# Altium schematic sheet FlowDiagramRev2.SchDoc
size A; SheetNumber: 9; SheetTotal: 14
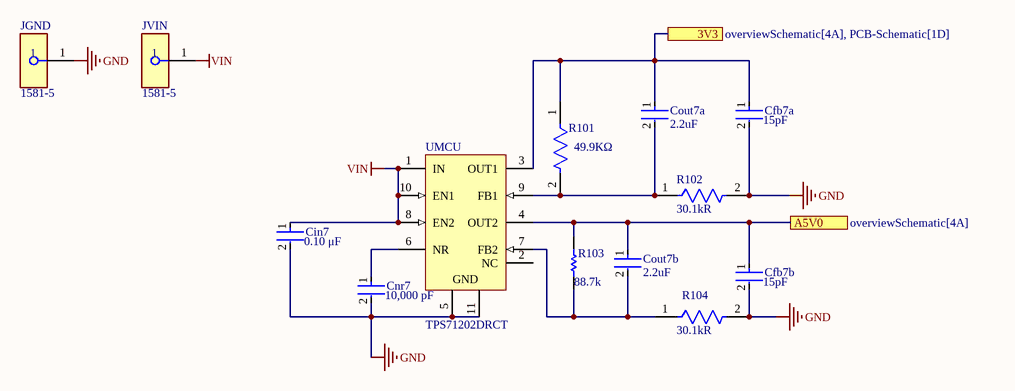
[diagram p0: FlowDiagramRev2.SchDoc]

## Parts
Cfb7a  Capacitance: 15pF  [FP-CC0402-0_55-IPC_B]  (hidden comment: CC0402JRNPO9BN150)
Cfb7b  Capacitance: 15pF  [FP-CC0402-0_55-IPC_B]  (hidden comment: CC0402JRNPO9BN150)
Cin7  Capacitance: 0.10 μF  [FP-C0603C-CF-MFG]  (hidden comment: C0603C104M4RACTU)
Cnr7  value 10,000 pF  [FP-C0603C-CF-MFG]  (hidden comment: C0603C103M5RACTU)
Cout7a  Capacitance: 2.2uF  [FP-GRM188-0_1-e0_2_0_5-MFG]  (hidden comment: GRM188R71A225KE15D)
Cout7b  Capacitance: 2.2uF  [FP-GRM188-0_1-e0_2_0_5-MFG]  (hidden comment: GRM188R71A225KE15D)
JGND  1581-5  [FP-1581-5-MFG]
JVIN  1581-5  [FP-1581-5-MFG]
R101  Resistance: 49.9KΩ  [FP-RT1206-MFG]  (hidden comment: RT1206FRE0749K9L)
R102  Resistance: 30.1kR  [FP-CRCW0603-HPe3-IPC_B]  (hidden comment: CRCW060330K1FKEAHP)
R103  RC0603FR-0788K7L  [RESC1608X55X25ML10T15]  (value not drawn)
R104  Resistance: 30.1kR  [FP-CRCW0603-HPe3-IPC_B]  (hidden comment: CRCW060330K1FKEAHP)
UMCU  TPS71202DRCT  [DRC0010L_V]

## Ports
3V3 (see overviewSchematic[4A], PCB-Schematic[1D]), A5V0 (see overviewSchematic[4A])

## Nets
GND: Cfb7a.2 Cfb7b.2 Cin7.2 Cnr7.2 JGND.1 R102.2 R104.2 UMCU.5(GND) UMCU.11(GND)
VIN: Cin7.1 JVIN.1 UMCU.1(IN) UMCU.8(EN2) UMCU.10(EN1)
3V3: Cfb7a.1 Cout7a.1 R101.1 UMCU.3(OUT1) ; port 3V3
A5V0: Cfb7b.1 Cout7b.1 R103.2 UMCU.4(OUT2) ; port A5V0
NetCnr7_1: Cnr7.1 UMCU.6(NR)
NetCout7a_2: Cout7a.2 R101.2 R102.1 UMCU.9(FB1)
NetCout7b_2: Cout7b.2 R103.1 R104.1 UMCU.7(FB2)

Not connected (* = marked no-connect by the designer): UMCU 2(NC)

## Notes on the sheet
- (near R103) 88.7k

## Library data of the parts
Cfb7a Cfb7b = CMP-03422-001519-1: CAP CER 15PF 50V C0G/NPO 0402; Insulation Resistance: 100GR; Dielectric Material: Ceramic; Tolerance: 5%; Dielectric: C0G; Width: 0.02inch; Case Code (Imperial): 0402; Voltage Rating (DC): 50V; Case Code (Metric): 1005; REACH SVHC: No SVHC; Mount: Surface Mount; Min Operating Temperature: -55°C; Depth: 0.5mm; Voltage Rating: 50V; Voltage: 50V; Thickness: 0.022inch; Length: 1mm; Max Operating Temperature: 125°C; Lead Free: Lead Free; Height: 0.5mm; Packaging: Tape and Reel; Radiation Hardening: No; Package Quantity: 1; Case/Package: 0402; Number of Pins: 2; RoHS Compliant: Yes; Resistor Type: Ceramic; Series: CC; Termination: SMD/SMT
Cin7 = CMP-2006-03067-2: CAP CER 0.1UF 16V X7R 0603; Manufacturer: KEMET; Temperature Coefficient: 30ppm/°C; Value: 0.10 μF; Tolerance: 0.2; Automotive Grade: Grade 1; Temperature Range Low: -55°C; Manufacturer Part Number: C0603C104M4RACTU; ComponentLink2Description: Datasheet; Mouser Description: Multilayer Ceramic Capacitors MLCC - SMD/SMT 16volts 0.1uF X7R 20%; ComponentLink2URL: https://api.kemet.com/component-edge/download/datasheet/C0603C100J5GACAUTO.pdf; Device Class L2: Capacitors; Automotive: Yes; Temperature Range High: +125°C; Voltage Rating: 16 V; Lead Free: Yes; Temperature Characteristic: X7R; Package: C0603C-CF; RoHS: TRUE; Device Class L1: Passive Components; Temperature: -55°C to +125°C; Digikey Description: CAP CER 0.1UF 16V X7R 0603; Category: Cap; Device Class L3: Ceramic Capacitors; Material: Ceramic; Octopart: https://octopart.com/c0603c104m4ractu-kemet-134275; Height: 0.87mm
Cnr7 = CMP-2006-03052-2: CAP CER 10000PF 50V 20% X7R 0603; Manufacturer: KEMET; Temperature Coefficient: 30ppm/°C; Automotive Grade: Grade 1; Tolerance: 0.2; Manufacturer Part Number: C0603C103M5RACTU; Device Class L2: Capacitors; Device Class L3: Ceramic Capacitors; RoHS: TRUE; Mouser Description: Multilayer Ceramic Capacitors MLCC - SMD/SMT 50volts 10000pF X7R 20%; Category: Cap; Temperature: -55°C to +125°C; ComponentLink2Description: Datasheet; Package: C0603C-CF; Octopart: https://octopart.com/c0603c103m5ractu-kemet-96399; ComponentLink2URL: https://api.kemet.com/component-edge/download/datasheet/C0603C100J5GACAUTO.pdf; Temperature Range High: +125°C; Material: Ceramic; Digikey Description: CAP CER 10000PF 50V 20% X7R 0603; Automotive: Yes; Height: 0.87mm; Voltage Rating: 50 V; Device Class L1: Passive Components; Capacitance: 10,000 pF; Temperature Range Low: -55°C; Lead Free: Yes; Temperature Characteristic: X7R
Cout7a Cout7b = CMP-2006-02836-2: Chip Multilayer Ceramic Capacitors for General Purpose, 0603, 2.2uF, X7R, 15%, 10%, 10V; Case Code (Metric): 1608; Height: 0.8mm; Packaging: Cut Tape; Voltage: 10V; Lead Free: Lead Free; Min Operating Temperature: -55°C; Voltage Rating (DC): 10V; Max Operating Temperature: 125°C; Voltage Rating: 10V; Dielectric: X7R; Depth: 0.8mm; Case Code (Imperial): 0603; Termination: SMD/SMT; Case/Package: 0603; Number of Pins: 2; REACH SVHC: No SVHC; Mount: Surface Mount; Width: 0.031inch; Material: Ceramic; Package Quantity: 1; Weight: 7.1E-05oz; Length: 1.6mm; Thickness: 0.035inch; Tolerance: 10%
JGND JVIN = CMP-73906-000011-1: CONN BANANA JACK TURRET GREEN; Body Material: PC; Number of Contacts: 1; Max Current Rating: 15A; Voltage Rating (AC): 30V; Insulation: Mating End Insulated; Voltage Rating: 2.5kV; Voltage Rating (DC): 60V; Gender: Female; Height: 0.25inch; Mount: Panel; RoHS Compliant: Yes; Length: 1.22inch; Orientation: Straight; Diameter: 4.22mm; Lead Free: Lead Free; Package Quantity: 1; Termination: Turret; Current Rating: 15A; Packaging: Bag; Series: 1581; REACH SVHC: No SVHC; Number of Positions: 1; Contact Plating: Tin; Housing Color: Green; Contact Material: Brass; Insulation Material: Polycarbonate; Weight: 0.126lb; Number of Ports: 1; Color: Green; Housing Material: Polycarbonate; Width: 4inch
R101 = CMP-2003-04140-2: RES SMD 49.9K OHM 1% 1/4W 1206; Manufacturer: Yageo; Temperature Coefficient: 50 ppm/°C; Voltage Rating: 200V; Power Rating: 0.25W; Tolerance: 0.0002; Value: 49.9KΩ; Temperature Range High: +155°C; RoHS: TRUE; ComponentLink2URL: http://www.yageo.com/documents/recent/PYu-RT_1-to-0.01_RoHS_L_9.pdf; Temperature Range Low: -55°C; Category: Res; Mouser Description: Thin Film Resistors - SMD 1/4W 49.9K ohm 1% 50ppm; Manufacturer Part Number: RT1206FRE0749K9L; Automotive: No; Device Class L1: Passive Components; Height: 0.65mm; Composition: Thin Film; Octopart: https://octopart.com/rt1206fre0749k9l-yageo-1248491; ComponentLink2Description: Datasheet; Package: RT1206; Lead Free: Yes; Temperature: -55°C to +155°C; Device Class L2: Resistors; Footprint Url: http://www.yageo.com/exep/pages/download/literatures/PYu-R_Mount_10.pdf; Ipc Land Pattern Name: RESC310160X55; Digikey Description: RES SMD 49.9K OHM 1% 1/4W 1206; Device Class L3: Chip SMD Resistors; Series: RT
R102 R104 = CMP-02407-008689-1: RES Thick Film, 30.1kΩ, 1%, 0.33W, 100ppm/°C, 0603; Max Power Dissipation: 250mW; Tolerance: 1%; Lead Free: Lead Free; Width: 0.033inch; Composition: Thick Film; Length: 0.063inch; Case/Package: 0603; Case Code (Metric): 1608; Temperature Coefficient: 100ppm/°C; Features: Automotive AEC-Q200; Package Quantity: 5000; Number of Terminations: 2; Max Operating Temperature: 155°C; Packaging: Tape and Reel; Case Code (Imperial): 0603; Min Operating Temperature: -55°C; Height: 0.022inch
R103 = CMP-2000-04152-1: Manufacturer: Yageo; Part Number: RC0603FR-0788K7L
UMCU = CMP-0389-00051-2: Dual Output High PSRR LDO, 200 mA, 2.7 to 5.5 V Input, 10-pin SON (DRC), -40 to 125 degC, Green (RoHS & no Sb/Br); Manufacturer: Texas Instruments; Iout2(A): 0.2; Vout(Max)(V): 5.5; Vout2(Min)(V): 1.2; Iq(Typ)(mA): 0.3; Vin(Min)(V): 2.7; Vdo(Typ)(mV): 125; SubFamily: Dual Channel LDO; DatasheetVersion: SBVS049D; Iout(Max)(A): 0.2; ComponentLink1URL: http://www.ti.com/; ComponentLink2Description: Datasheet; Eco-Plan: Green (RoHS & no Sb/Br); Vout2(Max)(V): 5.5; Mounting Technology: Surface Mount; PackageVersion: 4204102-3/L; ComponentLink1Description: Manufacturer URL; PackageDescription: 10-Pin Plastic Small Outline, Body 3 x 3 mm, Pitch 0.5 mm; Vout(Min)(V): 1.2; ComponentLink3Description: Package Specification; PartNumber: TPS71202DRCT; PackageReference: DRC0010L; Vin(Max)(V): 5.5; ComponentLink3URL: http://www.ti.com/litv/pdf/mpds117k; ComponentLink2URL: http://www.ti.com/general/docs/lit/getliterature.tsp?genericPartNumber=TPS71202&fileType=pdf